# EAGLE design kaga_iot (EAGLE 9.4.2)
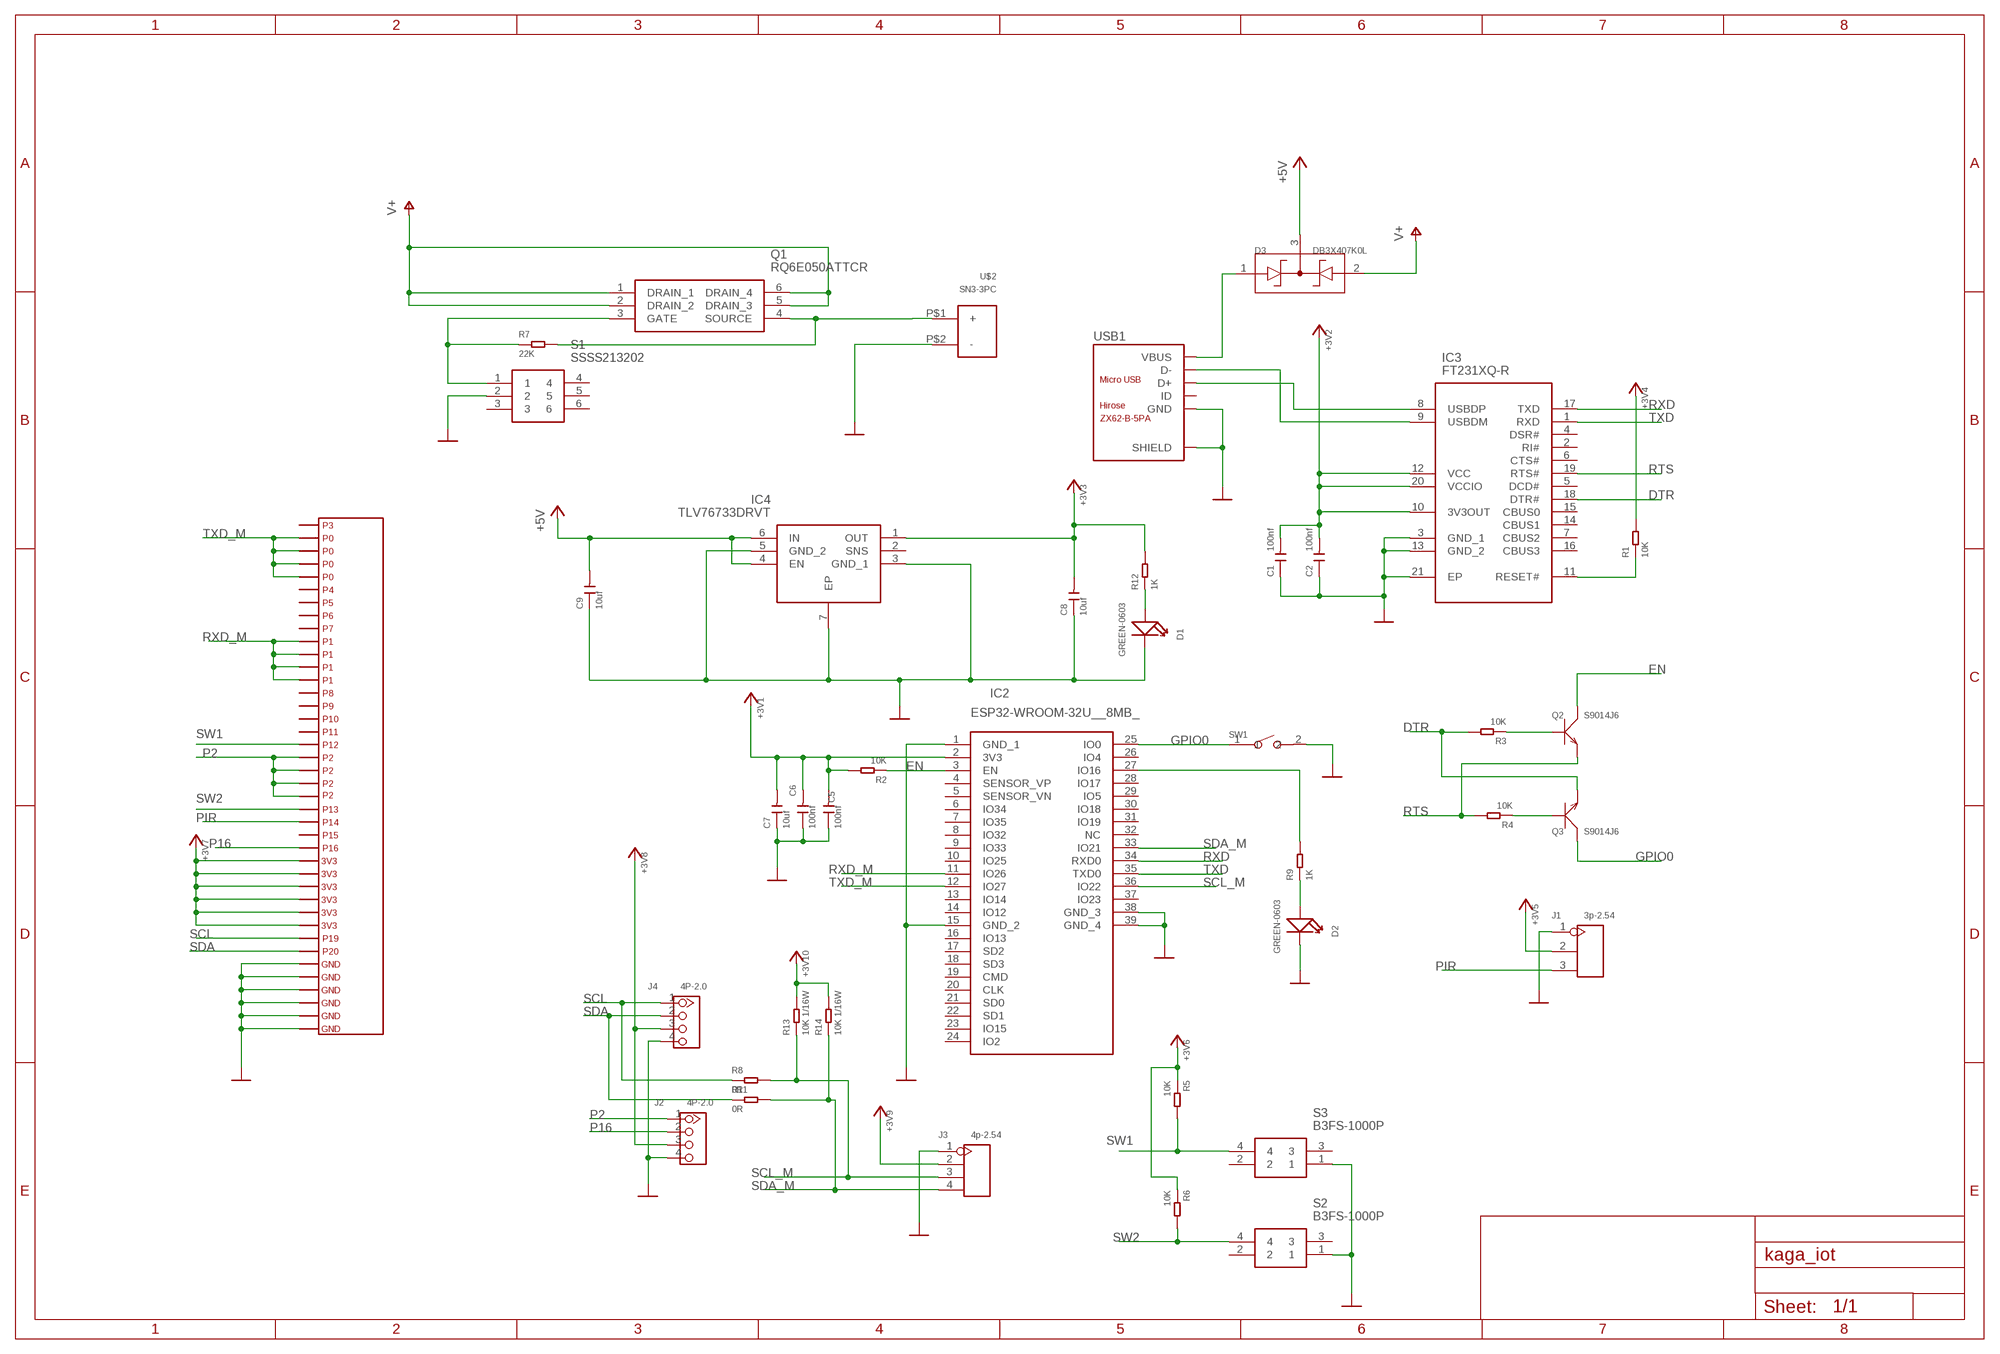
[diagram p0: schematic, sheet 1]

## Parts
C1  100nf  CERAMIC-100NF-50V-10%-X7R(0603)  [C0603]
C2  100nf  CERAMIC-100NF-50V-10%-X7R(0603)  [C0603]
C5  100nf  CERAMIC-100NF-50V-10%-X7R(0603)  [C0603]
C6  100nf  CERAMIC-100NF-50V-10%-X7R(0603)  [C0603]
C7  10uf  CERAMIC-10UF-10V-10%-X5R(0603)  [C0603]
C8  10uf  CERAMIC-10UF-10V-10%-X5R(0603)  [C0603]
C9  10uf  CERAMIC-10UF-10V-10%-X5R(0603)  [C0603]
D1  GREEN-0603  SMD-LED-CLEAR-GREEN(0603)  [LED-0603]
D2  GREEN-0603  SMD-LED-CLEAR-GREEN(0603)  [LED-0603]
D3  DB3X407K0L  SMD-DIODE-SCHOTTKY-30V-200MA(SOT-23)  [SOT-23]
IC2  ESP32-WROOM-32U__8MB_  [ESP32WROOM32U8MB]
IC3  FT231XQ-R  [QFN50P400X400X80-21N]
IC4  TLV76733DRVT  [SON65P200X200X80-7N]
J1  3p-2.54  DIP-BLACK-FEMALE-HEADER-VERT(3P-2.54)  [H3-2.54]
J2  4P-2.0  GROVE-CONNECTOR-DIP(4P-2.0)  [HW4-2.0]
J3  4p-2.54  DIP-BLACK-FEMALE-HEADER-VERT(4P-2.54)  [H4-2.54]
J4  4P-2.0  GROVE-CONNECTOR-DIP(4P-2.0)  [HW4-2.0]
Q1  RQ6E050ATTCR  [SOT95P280X100-6N]
Q2  S9014J6  SMD-TRANSISTOR-NPN-50V-100MA-S9014J6(SOT-23)  [SOT-23]
Q3  S9014J6  SMD-TRANSISTOR-NPN-50V-100MA-S9014J6(SOT-23)  [SOT-23]
R1  10K  SMD-RES-10K-1%-1/10W(0603)  [R0603]
R2  10K  SMD-RES-10K-1%-1/10W(0603)  [R0603]
R3  10K  SMD-RES-10K-1%-1/10W(0603)  [R0603]
R4  10K  SMD-RES-10K-1%-1/10W(0603)  [R0603]
R5  10K  SMD-RES-10K-1%-1/10W(0603)  [R0603]
R6  10K  SMD-RES-10K-1%-1/10W(0603)  [R0603]
R7  22K  SMD-RES-22K-1%-1/16W(0402)  [R0402]
R8  0R  SMD-RES-0R-5%-1/16W(0402)  [R0402]
R9  1K  SMD-RES-1K-1%-1/10W(0603)  [R0603]
R11  0R  SMD-RES-0R-5%-1/16W(0402)  [R0402]
R12  1K  SMD-RES-1K-1%-1/10W(0603)  [R0603]
R13  10K 1/16W  SMD-RES-10K-1%-1/16W(0402)  [R0402]
R14  10K 1/16W  SMD-RES-10K-1%-1/16W(0402)  [R0402]
S1  SSSS213202  [SSSS213202]
S2  B3FS-1000P  [B3FS-1000P]
S3  B3FS-1000P  [B3FS-1000P]
SW1  SMD-BUTTON(2P-3.0X2.5X1.2+0.4MM)-B3U-1000P-2P-SMD  [SW2-2.6-3.0X2.5X1.2+0.4MM]
U$1  SMD_BBC_EDG2  [SMD_BBC_EDG2]
U$2  SN3-3PC  [SN3-3PC]
USB1  ZX62-B-5PA  MICRO-USB-SMD(ZX62-B-5PA)  [MICRO-USB5+6P-SMD-0.65-AB]

## Nets
+3V3: C1.2 C2.2 C5.2 C6.2 C7.2 C8.2 IC2.2(3V3) IC3.10(3V3OUT) IC3.12(VCC) IC3.20(VCCIO) IC4.1(OUT) J1.2 J2.3 J3.2 J4.3 R1.2 R2.2 R5.1 R6.1 R12.2 R13.2 R14.2 U$1.P$49 U$1.P$50 U$1.P$51 U$1.P$52 U$1.P$53 U$1.P$54 ; supply symbol labelled POW_+3V3
+5V: C9.2 D3.3 IC4.4(EN) IC4.6(IN)
DTR: IC3.18(DTR#) Q3.2(E) R3.2
EN: IC2.3(EN) Q2.3(C) R2.1
GND: C1.1 C2.1 C5.1 C6.1 C7.1 C8.1 C9.1 D1.- D2.- IC2.1(GND_1) IC2.15(GND_2) IC2.38(GND_3) IC2.39(GND_4) IC3.3(GND_1) IC3.13(GND_2) IC3.21(EP) IC4.3(GND_1) IC4.5(GND_2) IC4.7(EP) J1.1 J2.4 J3.1 J4.4 S1.2 S2.1 S3.1 SW1.2 U$1.P$41 U$1.P$42 U$1.P$43 U$1.P$44 U$1.P$45 U$1.P$46 U$2.P$2(-) USB1.5(GND) USB1.P1(SHIELD) USB1.P2(SHIELD) USB1.P3(SHIELD) USB1.P4(SHIELD) USB1.P5(SHIELD) USB1.P6(SHIELD) ; supply symbol labelled POW_GND
GPIO0: IC2.25(IO0) Q3.3(C) SW1.1
N$1: IC3.8(USBDP) USB1.3(D+)
N$2: IC3.9(USBDM) USB1.2(D-)
N$3: IC3.11(RESET#) R1.1
N$4: D1.+ R12.1
N$6: D2.+ R9.1
N$7: IC2.27(IO16) R9.2
N$11: Q2.1(B) R3.1
N$12: Q3.1(B) R4.1
N$16: Q1.4(SOURCE) R7.2 U$2.P$1(+)
N$18: Q1.3(GATE) R7.1 S1.1
P2: J2.1 U$1.P$59 U$1.P$60 U$1.P$61 U$1.P$62
P16: J2.2 U$1.P$55
PIR: J1.3 U$1.P$57
RTS: IC3.19(RTS#) Q2.2(E) R4.2
RXD: IC2.34(RXD0) IC3.17(TXD)
RXD_M: IC2.11(IO26) U$1.P$68 U$1.P$69 U$1.P$70 U$1.P$71
SCL: J4.1 R8.1 U$1.P$48
SCL_M: IC2.36(IO22) J3.3 R8.2 R13.1
SDA: J4.2 R11.1 U$1.P$47
SDA_M: IC2.33(IO21) J3.4 R11.2 R14.1
SW1: R5.2 S3.4 U$1.P$63
SW2: R6.2 S2.4 U$1.P$58
TXD: IC2.35(TXD0) IC3.1(RXD)
TXD_M: IC2.12(IO27) U$1.P$76 U$1.P$77 U$1.P$78 U$1.P$79
V+: D3.2 Q1.1(DRAIN_1) Q1.2(DRAIN_2) Q1.5(DRAIN_3) Q1.6(DRAIN_4)
VBUS: D3.1 USB1.1(VBUS)
Unconnected: IC2.4(SENSOR_VP) IC2.5(SENSOR_VN) IC2.6(IO34) IC2.7(IO35) IC2.8(IO32) IC2.9(IO33) IC2.10(IO25) IC2.13(IO14) IC2.14(IO12) IC2.16(IO13) IC2.17(SD2) IC2.18(SD3) IC2.19(CMD) IC2.20(CLK) IC2.21(SD0) IC2.22(SD1) IC2.23(IO15) IC2.24(IO2) IC2.26(IO4) IC2.28(IO17) IC2.29(IO5) IC2.30(IO18) IC2.31(IO19) IC2.32(NC) IC2.37(IO23) IC3.2(RI#) IC3.4(DSR#) IC3.5(DCD#) IC3.6(CTS#) IC3.7(CBUS2) IC3.14(CBUS1) IC3.15(CBUS0) IC3.16(CBUS3) IC4.2(SNS) S1.3 S1.4 S1.5 S1.6 S2.2 S2.3 S3.2 S3.3 U$1.P$56 U$1.P$64 U$1.P$65 U$1.P$66 U$1.P$67 U$1.P$72 U$1.P$73 U$1.P$74 U$1.P$75 U$1.P$80 USB1.4(ID)

## Library data of the parts
C1 C2 C5 C6 = Seeed-OPL-Capacitor:CERAMIC-100NF-50V-10%-X7R(0603): 302010138; MPN: CC0603KRX7R9BB104
C7 = Seeed-OPL-Capacitor:CERAMIC-10UF-10V-10%-X5R(0603): 302010103; MPN: CC0603KRX5R6BB106
C8 C9 = Seeed-Capacitor:CERAMIC-10UF-10V-10%-X5R(0603): 302010103; MPN: CC0603KRX5R6BB106
D1 D2 = Seeed-OPL-Diode:SMD-LED-CLEAR-GREEN(0603): 304090043; MPN: 19-217-G7C-AN1P2-3T
D3 = Seeed-OPL-Diode:SMD-DIODE-SCHOTTKY-30V-200MA(SOT-23): 304020016; MPN: BAT54C-215; VALUE: 30V-200MA
IC2 = SamacSys_Parts:ESP32-WROOM-32U__8MB_: WiFi Modules (802.11) SMD Module, ESP32-D0WD, 64Mbits SPI flash, UART mode, U.FL antenna connector Source: Datasheet <https://www.mouser.de/datasheet/2/891/esp32-wroom-32d_esp32-wroom-32u_datasheet_en-1365844.pdf>; DESCRIPTION: WiFi Modules (802.11) SMD Module, ESP32-D0WD, 64Mbits SPI flash, UART mode, U.FL antenna connector; HEIGHT: 3.4mm; MANUFACTURER_NAME: Espressif; MANUFACTURER_PART_NUMBER: ESP32-WROOM-32U (8MB)
IC3 = SamacSys_Parts:FT231XQ-R: FTDI Chip FT231XQ-R, USB Transceiver Source: Datasheet <http://uk.rs-online.com/web/p/products/7570045P>; DESCRIPTION: FTDI Chip FT231XQ-R, USB Transceiver; HEIGHT: 0.8mm; MANUFACTURER_NAME: FTDI Chip; MANUFACTURER_PART_NUMBER: FT231XQ-R; RS_PART_NUMBER: 7570045P; RS_PRICE-STOCK: http://uk.rs-online.com/web/p/products/7570045P
IC4 = SamacSys_Parts:TLV76733DRVT: Adjustable and fixed 1-A 16-V positive-voltage low-dropout (LDO) linear regulator Source: Datasheet <http://www.ti.com/lit/gpn/TLV767>; DESCRIPTION: Adjustable and fixed 1-A 16-V positive-voltage low-dropout (LDO) linear regulator; HEIGHT: 0.8mm; MANUFACTURER_NAME: Texas Instruments; MANUFACTURER_PART_NUMBER: TLV76733DRVT
J1 = Seeed-OPL-Connector:DIP-BLACK-FEMALE-HEADER-VERT(3P-2.54): 320030024; MPN: F185-1103A0BSYA1
J2 J4 = Seeed-Connector:GROVE-CONNECTOR-DIP(4P-2.0): 320110033
J3 = Seeed-Connector:DIP-BLACK-FEMALE-HEADER-VERT(4P-2.54): 320030017; MPN: F185-1104A1BSYA1
Q1 = SamacSys_Parts:RQ6E050ATTCR: MOSFET,P-channel,30V,5A,SOT457T ROHM RQ6E050ATTCR Dual P-channel MOSFET Transistor, +/-5 A, -30 V, 6-Pin SOT-457T Source: Datasheet <http://uk.rs-online.com/web/p/products/1246805P>; DESCRIPTION: MOSFET,P-channel,30V,5A,SOT457T ROHM RQ6E050ATTCR Dual P-channel MOSFET Transistor, +/-5 A, -30 V, 6-Pin SOT-457T; HEIGHT: 1mm; MANUFACTURER_NAME: ROHM Semiconductor; MANUFACTURER_PART_NUMBER: RQ6E050ATTCR; RS_PART_NUMBER: 1246805P; RS_PRICE-STOCK: http://uk.rs-online.com/web/p/products/1246805P
Q2 Q3 = Seeed-OPL-Transistor:SMD-TRANSISTOR-NPN-50V-100MA-S9014J6(SOT-23): 305010022; MPN: S9014J6
R1-R6 = Seeed-Resistor:SMD-RES-10K-1%-1/10W(0603): 301010299; MPN: RC0603FR-0710KL
R7 = Seeed-OPL-Resistor:SMD-RES-22K-1%-1/16W(0402): 301010063; MPN: RC0402FR-0722KL
R8 R11 = Seeed-Resistor:SMD-RES-0R-5%-1/16W(0402): 301010000; MPN: RC0402JR-070RL
R9 R12 = Seeed-OPL-Resistor:SMD-RES-1K-1%-1/10W(0603): 301010298; MPN: RC0603FR-071KL
R13 R14 = Seeed-Resistor:SMD-RES-10K-1%-1/16W(0402): 301010047; MPN: RC0402FR-0710KL
S1 = SamacSys_Parts:SSSS213202: Slide Switches 1-pole 2-positions Surface Mount Slide Switch SPDT Maintained 0.3 A Slide Source: Datasheet <http://uk.rs-online.com/web/p/products/1238917>; DESCRIPTION: Slide Switches 1-pole 2-positions Surface Mount Slide Switch SPDT Maintained 0.3 A Slide; HEIGHT: mm; MANUFACTURER_NAME: ALPS; MANUFACTURER_PART_NUMBER: SSSS213202; RS_PART_NUMBER: 1238917; RS_PRICE-STOCK: http://uk.rs-online.com/web/p/products/1238917
S2 S3 = SamacSys_Parts:B3FS-1000P: Switch Tact,6x6mm,flat act,gen purp,tape Plunger Tactile Switch, SPST-NO 0.05 A@ 24 V dc 0.5mm Source: Datasheet <http://uk.rs-online.com/web/p/products/6821254P>; ALLIED_NUMBER: 70175891; DESCRIPTION: Switch Tact,6x6mm,flat act,gen purp,tape Plunger Tactile Switch, SPST-NO 0.05 A@ 24 V dc 0.5mm; HEIGHT: mm; MANUFACTURER_NAME: Omron Electronics; MANUFACTURER_PART_NUMBER: B3FS-1000P; RS_PART_NUMBER: 6821254P; RS_PRICE-STOCK: http://uk.rs-online.com/web/p/products/6821254P
SW1 = Seeed-OPL-Switch:SMD-BUTTON(2P-3.0X2.5X1.2+0.4MM): 311020047
U$1 = microbit:SMD_BBC_EDG2
U$2 = SamacSys_Parts:SN3-3PC
USB1 = Seeed-OPL-Connector:MICRO-USB-SMD(ZX62-B-5PA): 320010005; MPN: ZX62-B-5PA

## Board
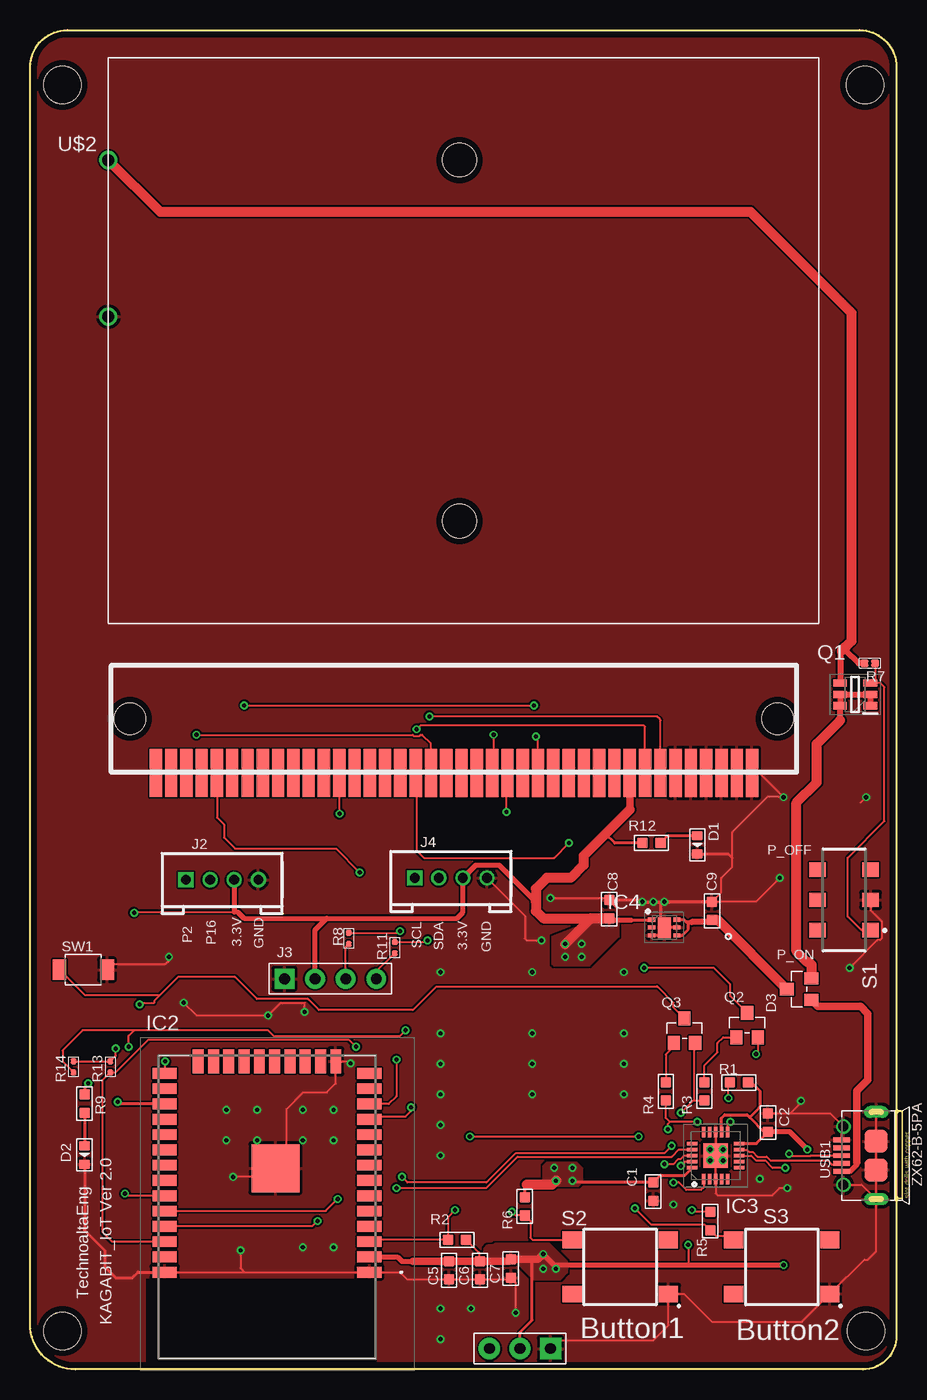
[diagram p1: board, top side]
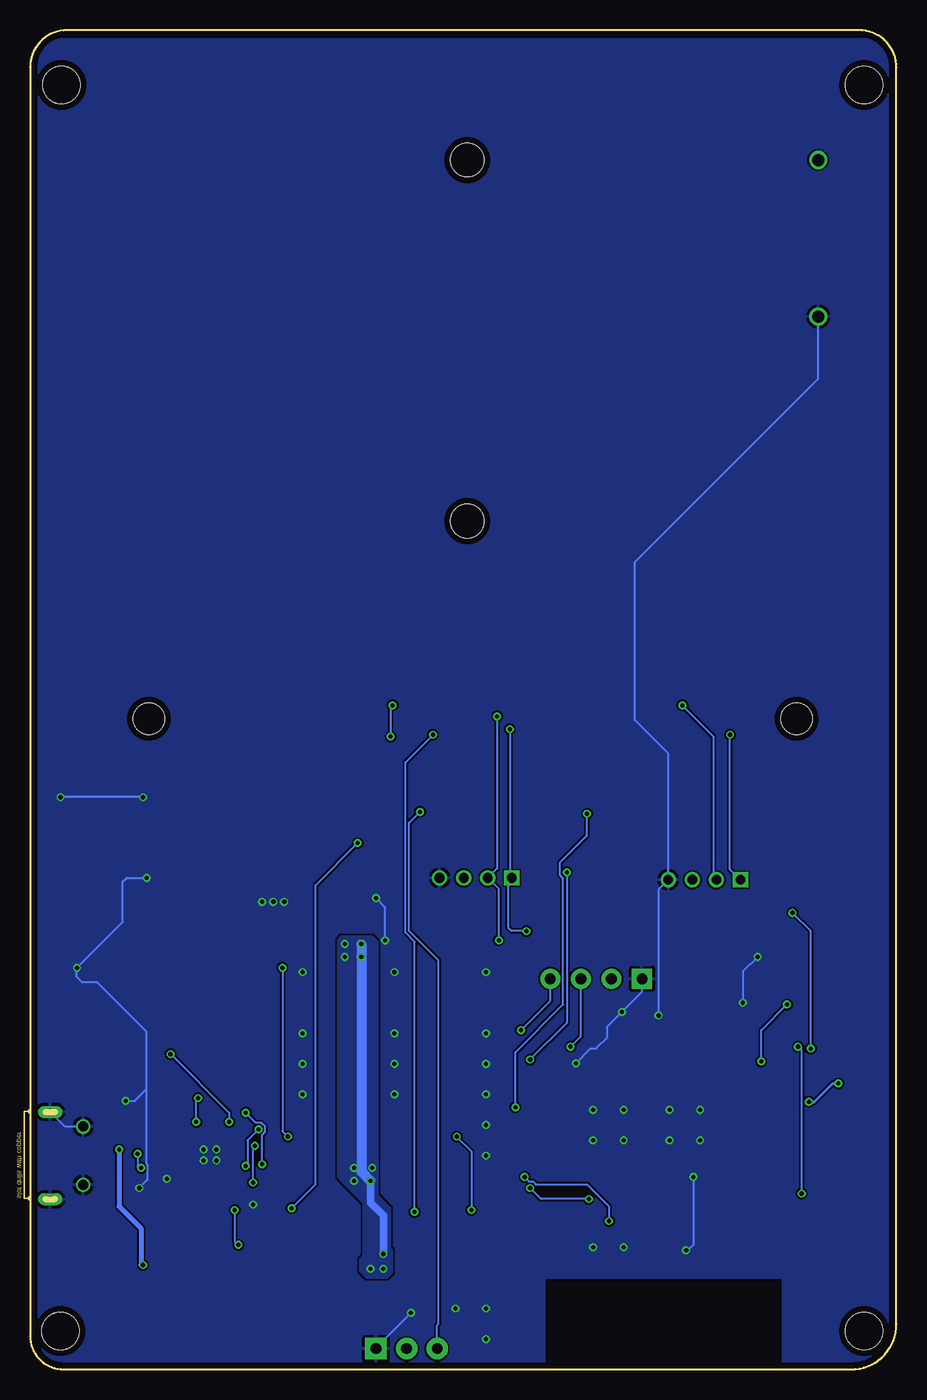
[diagram p2: board, bottom side, seen from below]

Size 71.96 x 111.23 mm. Coordinates in mm from the lower left corner, seen from the top.
Outline: 69.18,0 3.75,0 arc-90 0,3.75 0,108.12 arc-90 3.1,111.23 68.89,111.23 arc-90 71.96,108.16 71.96,2.78 arc-90 69.18,0
Copper layers (1*16): Top 0.035mm / dielectric 1.6mm / Bottom 0.035mm
Design rules "Elecrow_2-layer_PCB_eagle_rule": minimum track width 6mil, minimum drill 12mil, track to track 6mil, track to pad 6mil, pad to pad 6mil, via to via 8mil, smd to smd 0mil, copper to edge 20mil, drill to drill 10mil, minimum pad ring 6mil, minimum via ring 6mil, stop-mask expansion 0mil, vias tented up to drill 100mil, thermal gap 10mil
Holes 3.1 mm at 2.69,3.18 69.43,3.18 2.69,106.68 69.37,106.68

### Footprints (pad centres in the part's own frame; a part is rotated, then mirrored left to right if it is on the bottom)
C0603 = smd 0.889 x 0.889: 1 0,0.762; 2 0,-0.762
LED-0603 = smd 0.762 x 0.889: + -0.762,0; - 0.762,0
SOT-23 = smd 1.016 x 1.143: 1 -0.889,-1.016; 2 0.889,-1.016; 3 0,1.016
ESP32WROOM32U8MB = smd 2 x 0.9: 1 -7.4,8.41; 2 -7.4,7.14; 3 -7.4,5.87; 4 -7.4,4.6; 5 -7.4,3.33; 6 -7.4,2.06; 7 -7.4,0.79; 8 -7.4,-0.48; 9 -7.4,-1.75; 10 -7.4,-3.02; 11 -7.4,-4.29; 12 -7.4,-5.56; 13 -7.4,-6.83; 14 -7.4,-8.1; 25 9.6,-8.1; 26 9.6,-6.83; 27 9.6,-5.56; 28 9.6,-4.29; 29 9.6,-3.02; 30 9.6,-1.75; 31 9.6,-0.48; 32 9.6,0.79; 33 9.6,2.06; 34 9.6,3.33; 35 9.6,4.6; 36 9.6,5.87; 37 9.6,7.14; 38 9.6,8.41 | smd 0.9 x 2: 15 -4.615,-9.1; 16 -3.345,-9.1; 17 -2.075,-9.1; 18 -0.805,-9.1; 19 0.465,-9.1; 20 1.735,-9.1; 21 3.005,-9.1; 22 4.275,-9.1; 23 5.545,-9.1; 24 6.815,-9.1 | smd 4 x 4: 39 0.395,-0.225
QFN50P400X400X80-21N = smd 0.85 x 0.3: 1 -1.95,1; 2 -1.95,0.5; 3 -1.95,0; 4 -1.95,-0.5; 5 -1.95,-1; 11 1.95,-1; 12 1.95,-0.5; 13 1.95,0; 14 1.95,0.5; 15 1.95,1 | smd 0.3 x 0.85: 6 -1,-1.95; 7 -0.5,-1.95; 8 0,-1.95; 9 0.5,-1.95; 10 1,-1.95; 16 1,1.95; 17 0.5,1.95; 18 0,1.95; 19 -0.5,1.95; 20 -1,1.95 | smd 2.05 x 2.05: 21 0,0
SON65P200X200X80-7N = smd 0.6 x 0.35: 1 -1.05,0.65; 2 -1.05,0; 3 -1.05,-0.65; 4 1.05,-0.65; 5 1.05,0; 6 1.05,0.65 | smd 1.1 x 1.7: 7 0,0
H3-2.54 = drill 0.889 pad 1.778 square: 1 0,2.54 | drill 0.889 pad 1.778: 2 0,0; 3 0,-2.54
HW4-2.0 = drill 0.8 pad 1.27 square: 1 -3,0 | drill 0.8 pad 1.27: 2 -1,0; 3 1,0; 4 3,0
H4-2.54 = drill 0.889 pad 1.651 square: 1 0,3.81 | drill 0.889 pad 1.651: 2 0,1.27; 3 0,-1.27; 4 0,-3.81
SOT95P280X100-6N = smd 1.15 x 0.6: 1 -1.25,0.95; 2 -1.25,0; 3 -1.25,-0.95; 4 1.25,-0.95; 5 1.25,0; 6 1.25,0.95
R0603 = smd 0.889 x 0.889: 1 0,0.762; 2 0,-0.762
R0402 = smd 0.635 x 0.635: 1 0,0.445; 2 0,-0.445
R0402' = smd 0.5 x 0.5: 1 0,0.463; 2 0,-0.463
SSSS213202 = smd 1.2 x 1.4: 1 -2.5,-2.2; 2 0,-2.2; 3 2.5,-2.2; 4 -2.5,2.2; 5 0,2.2; 6 2.5,2.2
B3FS-1000P = smd 1.6 x 1.4: 1 4,-2.25; 2 -4,-2.25; 3 4,2.25; 4 -4,2.25
SW2-2.6-3.0X2.5X1.2+0.4MM = smd 1.152 x 1.7: 1 -1.976,0; 2 1.976,0
SMD_BBC_EDG2 = smd 1.02 x 4: P$41 26.035,1.85; P$42 24.765,1.85; P$43 23.495,1.85; P$44 22.225,1.85; P$45 20.955,1.85; P$46 19.685,1.85; P$47 18.415,1.85; P$48 17.145,1.85; P$49 15.875,1.85; P$50 14.605,1.85; P$51 13.335,1.85; P$52 12.065,1.85; P$53 10.795,1.85; P$54 9.525,1.85; P$55 8.255,1.85; P$56 6.985,1.85; P$57 5.715,1.85; P$58 4.445,1.85; P$59 3.175,1.85; P$60 1.905,1.85; P$61 0.635,1.85; P$62 -0.635,1.85; P$63 -1.905,1.85; P$64 -3.175,1.85; P$65 -4.445,1.85; P$66 -5.715,1.85; P$67 -6.985,1.85; P$68 -8.255,1.85; P$69 -9.525,1.85; P$70 -10.795,1.85; P$71 -12.065,1.85; P$72 -13.335,1.85; P$73 -14.605,1.85; P$74 -15.875,1.85; P$75 -17.145,1.85; P$76 -18.415,1.85; P$77 -19.685,1.85; P$78 -20.955,1.85; P$79 -22.225,1.85; P$80 -23.495,1.85 | hole 2.6: -25.629,6.35; 28.169,6.35
SN3-3PC = drill 1: P$1 0,10.5; P$2 0,-2.5 | hole 2.8: 29.15,10.5; 29.15,-19.5
MICRO-USB5+6P-SMD-0.65-AB = smd 0.4 x 1.35: 1 -1.3,2.875; 2 -0.65,2.875; 3 0,2.875; 4 0.65,2.875; 5 1.3,2.875 | smd 1.9 x 1.9: P1 -1.2,0; P2 1.2,0 | drill 0.508 pad 1.016 long: P3 -3.625,0; P4 3.625,0 | drill 0.8: P5 -2.425,2.73; P6 2.425,2.73

### Placement (x,y rotation side)
C1  51.77,14.76 180 top
C2  61.29,20.5 0 top
C5  34.8,8.23 180 top
C6  37.36,8.23 180 top
C7  39.93,8.38 180 top
C8  48.11,38.23 0 top
C9  56.64,38.07 0 top
D1  55.42,43.56 270 top
D2  4.52,17.81 270 top
D3  63.88,31.57 90 top
IC2  20.78,16.48 180 top
IC3  56.95,17.75 90 top
IC4  52.68,36.7 0 top
J1  40.69,1.73 270 top
J2  15.95,40.67 0 top
J3  24.94,32.44 90 top
J4  34.95,40.82 0 top
Q1  68.53,56.06 180 top
Q2  59.56,28.6 0 top
Q3  54.36,28.14 0 top
R1  58.88,23.83 90 top
R2  35.46,10.77 90 top
R3  56.01,23.09 0 top
R4  52.81,23.09 0 top
R5  56.49,12.32 0 top
R6  41.1,13.54 0 top
R7  69.75,58.65 270 top
R8  0R  [R0402']  26.47,35.79 0 top
R9  4.52,22.07 180 top
R11  0R  [R0402']  30.28,35.03 0 top
R12  51.61,43.71 270 top
R13  10K 1/16W  [R0402']  6.65,25.12 180 top
R14  10K 1/16W  [R0402']  3.61,25.12 180 top
S1  67.61,38.99 90 top
S2  49.02,8.51 0 top
S3  62.43,8.51 0 top
SW1  4.42,33.2 0 top
U$1  33.93,47.68 0 top
U$2  6.5,89.94 0 top
USB1  70.28,17.75 90 top

### Tracks (layer width: path | path; a pad name or v marks a point on that pad's centre or on a via)
+3V3  (via drill 0.35)
  Top 0.152: R2.2 37.29,9.7 37.29,8.99 | v54.97,13.23 55.12,13.08 R5.1 | v54.66,10.34 54.66,8.66 | R14.2 R13.2 7.11,26.04 v7.11,26.64 | v8.64,37.92 8.7,37.99 16.95,37.99 17.26,37.99 | U$1.P$54 U$1.P$53 U$1.P$52 U$1.P$51 U$1.P$50 U$1.P$49
  Top 0.254: R6.1 41.1,15.21 41.25,15.37 | J1.2 40.69,3.07 41.71,4.09 41.71,9.14 | IC3.12 57.4,19.75 57.4,20.85 57.71,21.16 59.54,21.16 59.77,20.93 | 61.37,19.74 60.96,19.74 59.77,20.93 | IC3.10 60.33,18.75 61.19,19.61 61.19,19.63 | R1.2 59.92,23.83 60.6,23.14 60.6,21.79 60.57,21.75 60.57,21.73 59.77,20.93 | v45.06,15.67 45.21,15.52 C1.2 52.37,16.13 54.37,16.13 IC3.20 | R12.2 48.56,43.71 47.8,44.48 | IC4.1 51.59,37.31 49.94,37.31
  Top 0.406: IC2.2 30.51,9.34 30.89,8.97 31.8,8.97 | v64.57,18.26 63.09,19.74 61.37,19.74 C2.2 61.19,19.63 | v62.59,8.66 54.66,8.66 43.54,8.66 v42.62,9.58 | J2.3 16.95,37.99 | 17.26,37.99 17.78,37.46 24.64,37.46 | 24.64,37.46 35.46,37.46 35.95,37.96 J4.3 37,41.87 38.98,41.87 42.01,38.84 | J3.2 23.67,36.5 24.64,37.46 | 49.94,37.31 48.26,37.31 C8.2
  Top 0.61: 31.8,8.97 34.77,8.97 C5.2 37.29,8.99 C6.2 39.78,8.99 C7.2 41.71,9.14 42.19,9.14 v42.62,9.58 | U$1.P$49 49.81,46.48
  Top 0.813: v44.45,35.33 46.58,37.46 C8.2 42.62,37.46 42.01,38.07 42.01,38.84 42.01,39.9 42.93,40.82 44.91,40.82 45.97,41.88 45.97,42.65 47.8,44.48 49.81,46.48 | v43.69,15.67 43.38,15.37 41.25,15.37
  Bottom 0.152: v54.97,13.23 54.97,10.64 v54.66,10.34 | v7.11,26.64 7.11,36.4 v8.64,37.92
  Bottom 0.406: v64.57,18.26 64.57,13.54 62.74,11.71 62.74,8.66 v62.59,8.66
  Bottom 0.61: v42.62,9.58 42.62,12.78 43.69,13.84 v43.69,15.67
  Bottom 0.813: v44.45,35.33 v44.45,34.26 44.45,16.43 v43.69,15.67
  other vias: 45.82,35.33 45.82,34.26 43.54,16.74 45.06,16.74 43.69,8.36 42.62,8.36
  pour Top: 43.38,35.94 48.11,37.77 48.87,37.01 48.87,35.94 46.43,33.5 43.54,33.5 43.38,33.66
  pour Top: 42.93,17.2 45.36,17.2 45.82,16.74 45.82,15.52 45.52,15.21 42.93,15.21 42.62,15.52 42.62,16.89
  pour Bottom: 43.54,35.94 46.13,35.94 46.43,35.64 46.43,15.98 45.82,15.37 44.3,13.84 44.3,12.78 44.3,9.42 44.6,9.12 44.6,8.2 44.3,7.9 43.99,7.59 42.32,7.59 41.86,8.05 41.86,8.36 41.86,9.88 42.01,10.03 42.01,13.39 42.47,13.84 43.08,14.45 43.08,17.04 43.08,35.48
  pour Top: 43.69,7.44 41.86,7.44 41.25,8.05 40.79,8.51 40.79,8.66 40.64,8.81 38.66,8.81 37.74,8.81 37.74,10.03 38.05,10.34 38.51,10.34 38.66,10.49 40.34,10.49 43.08,10.49 44.15,9.42 44.6,8.97 44.6,8.36 44.6,8.05 43.99,7.44
+5V
  Top 0.254: 54.97,37.16 54.66,37.16 | 54.66,37.16 54.51,37.16 54.32,37.35 IC4.6 | 54.66,37.16 54.66,36.55 54.16,36.05 IC4.4
  Top 0.508: 54.97,37.16 56.49,37.16 C9.2
  Top 0.813: D3.3 57.12,37.31 C9.2
DTR  (via drill 0.35)
  Top 0.152: R3.2 55.12,22.33 55.12,22.38 | Q3.2 55.12,27 55.12,22.38 | IC3.18 54.3,17.75 54,17.45 53.82,17.45 53.42,17.04 v52.68,17.04 | v54.05,21.31 55.12,22.38
  Bottom 0.152: v52.68,17.04 52.68,19.46 52.43,19.71 52.43,20.17 52.75,20.49 53.24,20.49 v54.05,21.31
EN  (via drill 0.35)
  Top 0.152: Q2.3 58.17,31.01 58.17,31.98 56.79,33.35 v51,33.35 | v50.55,19.33 v36.52,19.33 | v35.31,13.23 34.7,12.62 34.7,10.79 | 34.7,10.79 R2.1 | IC2.3 28.36,10.79 34.7,10.79
  Bottom 0.152: v51,33.35 51,19.79 v50.55,19.33 | v36.52,19.33 35.31,18.11 v35.31,13.23
GND  (via drill 0.35)
  Top 0.152: 67.47,20.26 66.47,21.26 C2.1 63.14,21.26 64.11,22.22 v64.03,22.3 | 67.47,20.26 USB1.P6 | USB1.5 67.41,20.19 67.47,20.26 | USB1.P5 69.08,15.33 USB1.P3 | USB1.P3 USB1.P1 USB1.P2 USB1.P4 | J1.1 43.92,2.41 51.76,2.41 53.02,3.67 S2.1 54.32,6.26 56.64,3.94 64.11,3.94 S3.1 69.29,9.12 69.6,9.12 70.28,9.8 USB1.P3 | C7.1 39.99,7.56 | 39.99,7.56 40.33,7.21 v40.33,4.7 | 39.99,7.56 39.9,7.47 C6.1 C5.1 31.32,7.47 30.71,8.07 IC2.1 17.78,8.07 | IC2.38 11.84,8.07 17.78,8.07 | v16.87,15.98 19.65,15.98 IC2.39 21.28,17.61 21.28,21.62 22.66,22.99 24.64,22.99 25.39,23.74 IC2.15 26.46,25.58 v26.62,25.43 | v17.47,9.88 17.47,8.38 17.78,8.07 | 58.32,41.73 58.32,42.49 58.32,44.63 61.29,47.6 62.51,47.6 | 58.32,41.73 58.32,41.72 | 60.58,49.53 62.51,47.6 | 62.51,47.6 v62.59,47.52 | v69.44,47.52 68.99,47.07 | S1.2 69.81,38.11 70.74,37.18 70.74,35.79 70.61,35.66 70.38,35.66 v68.07,33.35 | v62.28,40.82 60.3,38.84 C9.1 57.4,39.6 57.4,40.82 58.32,41.73 | J4.4 41.1,37.67 41.1,35.79 41.25,35.64 v42.47,35.64 | v43.23,39.14 47.95,39.14 C8.1 | v62.89,15.06 62.28,15.06 61.67,14.45 57.1,14.45 56.95,14.6 IC3.3 IC3.21 IC3.13 | v22.81,29.69 22.81,30.45 20.83,30.45 v19.76,29.39 13.82,29.39 v12.75,30.45 | v11.53,34.26 11.53,33.96 11.23,33.65 6.85,33.65 SW1.2 | U$1.P$46 U$1.P$45 U$1.P$44 U$1.P$43 U$1.P$42 U$1.P$41
  Top 0.254: C8.1 50.7,38.99 v50.85,38.84 v51.76,38.84 v52.68,38.84 | 52.53,38.84 52.37,38.68 52.37,37.01 IC4.7 | IC4.5 IC4.7 | IC4.3 51.67,36.09 52.68,36.09 IC4.7 | D1.- 58.01,42.8 58.32,42.49 | D2.- 4.52,11.56 6.2,9.88 6.2,8.51 7.11,7.59 8.48,7.59 8.96,8.07 11.84,8.07
  Top 0.305: 52.53,38.84 v52.68,38.84 C9.1 | 48.64,38.46 C8.1
  Bottom 0.152: USB1.P4 69.08,20.18 USB1.P6 | v40.33,4.7 43.23,1.8 J1.1 | v16.87,15.98 16.87,10.34 17.32,9.88 v17.47,9.88 | v19.76,29.39 19.76,39.86 J2.4 18.95,51.13 21.74,53.92 21.74,67.03 6.5,82.27 U$2.P$2 | v62.59,47.52 v69.44,47.52 | v62.28,40.82 63.96,40.82 64.26,40.51 64.26,37.16 v68.07,33.35 68.07,32.59 67.61,32.13 66.4,32.13 62.28,28.02 62.28,23.29 | v42.47,35.64 42.47,38.38 v43.23,39.14 | 62.28,23.29 62.28,17.07 62.18,16.97 62.18,15.77 v62.89,15.06 | v26.62,25.43 25.4,26.64 24.94,26.64 24.03,27.56 24.03,28.47 v22.81,29.69 21.13,31.37 J3.1 | v11.53,34.26 12.75,33.05 v12.75,30.45 | v64.03,22.3 63.27,22.3 62.28,23.29
  other vias: 18.85,19.02 18.85,21.56 16.31,19.02 16.31,21.56 22.66,21.56 22.66,19.02 25.2,19.02 25.2,21.56 34.09,17.75 34.09,20.29 34.09,22.83 34.09,25.37 34.09,27.91 41.71,27.91 41.71,25.37 41.71,22.83 49.33,27.91 49.33,25.37 49.33,22.83 34.09,2.51 25.2,10.13 22.66,10.13 36.63,5.05 34.09,5.05 41.71,32.99 34.09,32.99 49.33,32.99 56.49,18.26 57.56,18.26 57.56,17.35 56.49,17.35 60.6,15.82 53.44,13.69
  pour Top (rank 4): -0.2,-2.57 -0.2,111.73 73.46,111.73 73.46,-0.03 28.91,-0.03 28.91,7.59 9.5,7.59 9.5,-0.03 1.07,-0.03 1.07,-2.57
  pour Bottom (rank 4): -0.2,-0.03 -0.2,110.46 74.73,110.46 74.73,-0.03 29.21,-0.03 29.21,7.59 9.5,7.59 9.5,-0.03
GPIO0  (via drill 0.35)
  Top 0.152: Q3.3 53.44,30.07 53.44,30.45 52.15,31.75 | 52.15,31.75 52.07,31.83 | IC2.25 11.23,24.63 v11.23,25.58 | v9.09,30.3 9.25,30.45 10.31,30.45 10.31,30.61 10.77,31.06 | 10.77,31.06 4.58,31.06 SW1.1 | 52.15,31.75 33.71,31.75 31.8,29.84 24,29.84 23.09,30.76 18.85,30.76 17.02,32.59 12.29,32.59 10.77,31.06
  Bottom 0.152: v11.23,25.58 11.23,28.17 v9.09,30.3
N$1  (via drill 0.35)
  Top 0.152: USB1.3 64.84,17.75 64.8,17.71 63.14,17.71 63.04,17.81 v63.04,17.9 | v62.74,16.74 61.67,16.74 61.06,17.35 60.3,17.35 59.89,17.75 IC3.8
  Bottom 0.152: v63.04,17.9 63.04,16.89 62.89,16.74 v62.74,16.74
N$2
  Top 0.152: USB1.2 67.35,17.04 66.55,17.04 66.24,17.35 61.49,17.35 61.19,17.65 60.43,17.65 60.02,18.06 59.74,18.06 59.55,18.25 IC3.9
N$3  (via drill 0.35)
  Top 0.152: IC3.11 57.95,20.48 58.01,20.55 v58.17,20.55 | v58.01,22.53 58.01,23.72 R1.1
  Bottom 0.152: v58.17,20.55 58.17,22.38 v58.01,22.53
N$4
  Top 0.254: R12.1 52.98,44.32 D1.+
N$6
  Top 0.254: R9.1 D2.+
N$7  (via drill 0.35)
  Top 0.254: IC2.27 7.44,22.04 v7.26,22.22 | v4.83,23.75 4.52,23.44 R9.2
  Bottom 0.254: v7.26,22.22 6.81,22.22 5.28,23.75 v4.83,23.75
N$11
  Top 0.152: R3.1 56.01,25.25 57.1,26.34 57.1,27.1 57.58,27.58 Q2.1
N$12
  Top 0.152: Q3.1 53.47,26.82 52.81,26.16 R4.1
N$16
  Top 0.508: 67.46,59.72 67.28,59.53 Q1.4 | R7.2 68.83,58.65 67.77,59.72 67.77,60.02
  Top 0.813: U$2.P$1 10.8,96.14 59.84,96.14 68.22,87.76 68.22,60.48 67.77,60.02 67.46,59.72
N$18
  Top 0.152: S1.1 69.05,36.49 67.92,37.62 67.92,42.49 70.97,45.54 70.97,56.67 70.63,57.01 69.9,57.01 | 69.9,57.01 Q1.3 | R7.1 70.19,57.3 69.9,57.01
P2  (via drill 0.35)
  Top 0.152: v13.82,52.7 31.78,52.7 31.87,52.61 32.34,52.61 32.43,52.7 32.56,52.7 33.3,51.97 U$1.P$62 U$1.P$61 U$1.P$60 U$1.P$59
  Bottom 0.152: J2.1 13.82,41.53 v13.82,52.7
P16  (via drill 0.35)
  Top 0.152: v17.78,55.14 v41.86,55.14 | v42.01,52.55 42.19,52.37 U$1.P$55
  Bottom 0.152: J2.2 15.19,40.9 15.19,52.55 v17.78,55.14 | v41.86,55.14 42.01,54.99 v42.01,52.55
PIR  (via drill 0.35)
  Top 0.152: v39.57,46.3 39.57,48.74 | 39.57,48.74 39.57,49.45 | U$1.P$57 39.65,48.82 39.57,48.74
  Bottom 0.152: J1.3 38.15,3.68 38.05,3.78 38.05,33.96 40.49,36.4 40.49,45.39 v39.57,46.3
RTS  (via drill 0.35)
  Top 0.152: v55.42,20.55 53.14,20.55 | R4.2 52.81,20.88 53.14,20.55 | Q2.2 60.45,26.34 v60.3,26.19 | IC3.19 54.41,17.25 v54.05,16.89 | v52.98,19.94 52.98,20.4 53.14,20.55
  Bottom 0.152: 55.57,20.55 v55.42,20.55 55.42,21.31 v60.3,26.19 | v54.05,16.89 53.9,17.04 53.9,19.02 v52.98,19.94
RXD  (via drill 0.35)
  Top 0.152: IC2.34 24.56,13.15 v25.55,14.15 | v30.43,15.06 37.9,15.06 40.49,17.65 53.29,17.65 53.9,18.26 IC3.17
  Bottom 0.152: v25.55,14.15 29.51,14.15 v30.43,15.06
RXD_M  (via drill 0.35)
  Top 0.152: IC2.11 28.41,21.01 31.19,21.01 31.65,21.46 v31.65,21.77 | v25.7,46.15 25.7,49.5 U$1.P$68 U$1.P$69 U$1.P$70 U$1.P$71
  Bottom 0.152: v31.65,21.77 31.65,26.34 27.69,30.3 27.69,40.79 27.94,41.04 27.94,42.09 25.7,44.32 v25.7,46.15
SCL  (via drill 0.35)
  Top 0.152: v32.11,53.16 32.41,53.47 51,53.47 51.08,53.39 U$1.P$48 | 26.31,36.09 R8.1 30.59,36.25 v30.73,36.4
  Bottom 0.152: v32.11,53.16 32.11,40.97 J4.1 32.25,40.51 32.25,36.71 31.95,36.4 v30.73,36.4
SCL_M  (via drill 0.35)
  Top 0.152: IC2.36 6.83,10.61 6.04,11.4 6.04,24.05 R13.1 7.11,24.66 9.85,27.41 26.47,27.41 v27.08,26.8 | J3.3 26.21,35.07 R8.2
  Bottom 0.152: v27.08,26.8 26.21,27.66 J3.3
SDA  (via drill 0.35)
  Top 0.152: 52.35,53.9 52.37,53.92 52.35,53.95 | v33.17,54.23 52.07,54.23 52.3,54 52.35,53.95 | 33.93,40.82 J4.2 | R11.1 32.87,35.49 v33.02,35.64 | U$1.P$47 52.35,53.95
  Bottom 0.152: v33.17,54.23 33.17,41.6 J4.2 33.02,39.89 v33.02,35.64
SDA_M  (via drill 0.35)
  Top 0.152: 8.64,28.17 19.76,28.17 20.22,27.71 30.73,27.71 v31.19,28.17 | 8.64,28.17 4.37,28.17 2.69,26.49 2.69,25.57 R14.1 | J3.4 28.75,33.04 R11.2 | IC2.33 8.05,14.42 v7.87,14.6 | v8.18,26.8 8.18,27.71 8.64,28.17
  Bottom 0.152: v31.19,28.17 28.75,30.61 J3.4 | v7.87,14.6 7.87,26.49 v8.18,26.8
SW1  (via drill 0.35)
  Top 0.152: v50.24,13.39 51.61,12.01 56.03,12.01 R5.2 56.95,11.1 58.09,11.1 S3.4 | 32.03,48.97 32.11,48.89 32.11,43.1 32.71,42.49 43.54,42.49 v44.75,43.71 | 32.03,48.97 31.95,49.05 31.95,49.45 | U$1.P$63 32.03,48.97
  Bottom 0.152: v50.24,13.39 48.26,15.37 48.26,40.21 v44.75,43.71
SW2  (via drill 0.35)
  Top 0.152: v40.03,13.08 40.33,12.78 R6.2 41.55,12.32 41.55,10.95 41.74,10.76 S2.4 | v38.51,52.7 38.51,50.72 | 38.51,50.72 38.51,49.65 | U$1.P$58 38.38,50.6 38.51,50.72
  Bottom 0.152: v40.03,13.08 40.03,35.51 40.79,36.27 40.79,50.42 v38.51,52.7
TXD  (via drill 0.35)
  Top 0.152: v30.89,15.98 31.34,15.52 37.9,15.52 40.33,17.96 52.68,17.96 v53.29,18.57 | v23.88,12.32 23.44,11.88 IC2.35 | IC3.1 55.95,15.13 55.73,14.91 54.51,14.91 53.9,15.52 v53.44,15.52
  Bottom 0.152: v30.89,15.98 30.53,15.62 30.2,15.62 29.95,15.37 25.7,15.37 23.88,13.54 v23.88,12.32 | v53.44,15.52 53.44,18.41 v53.29,18.57
TXD_M  (via drill 0.35)
  Top 0.152: 15.52,49.5 15.52,45.82 16.1,45.24 16.1,44.17 17.02,43.26 25.4,43.26 v27.38,41.27 | v30.43,25.73 30.43,22.68 29.79,22.04 IC2.12 | 15.52,49.5 15.5,49.53 U$1.P$77 U$1.P$78 U$1.P$79 | U$1.P$76 15.52,49.5
  Bottom 0.152: v27.38,41.27 27.38,28.78 v30.43,25.73
V+
  Top 0.508: Q1.1 Q1.2 Q1.5 Q1.6 67.28,53.89
  Top 0.813: D3.2 64.9,33.63 64.72,33.81 64.57,33.81 63.65,34.72 63.65,47.07 65.33,48.74 65.33,51.94 67.28,53.89
VBUS
  Top 0.406: 68.68,17.2 68.68,17 68.13,16.45 USB1.1
  Top 0.61: D3.1 65.43,30.15 68.99,30.15 69.6,29.54 69.6,24.05 68.68,23.14 68.68,17.2

### Text on the board
tPlace: Button1 | Button2
tNames: P_OFF | P2 | P16 | 3.3V | GND | SCL | SDA | 3.3V | GND | P_ON | KAGABIT_IoT Ver 2.0 | TechnoaltaEng